# Altium schematic sheet fpga-misc-inside.SchDoc
size Letter; CheckedBy: E. Chiu; CompanyName: Brinton Engineering, LLC; DrawnBy: J. Brinton; Engineer: J. Brinton; Address1: 3479 Edison Way; Address2: Menlo Park CA 94025; Address3: +1 (877) 778-8435; Address4: brintonengineering.com; Revision: 1; SheetNumber: 18; SheetTotal: 60
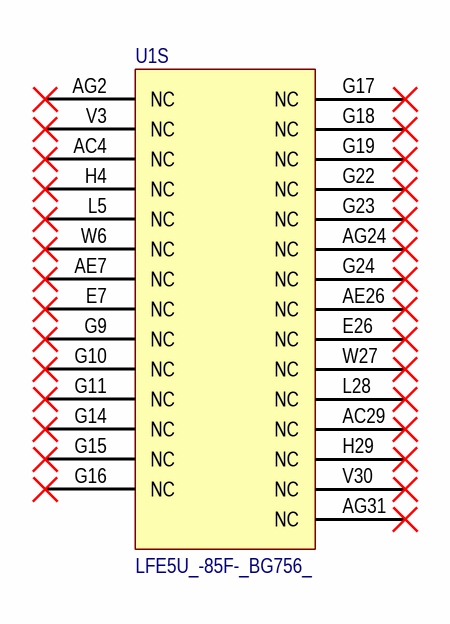
[diagram p0: fpga-misc-inside.SchDoc]

## Parts
U1  LFE5U_-85F-_BG756_  [caBGA756]  (part S of 19)

## Nets

Not connected (* = marked no-connect by the designer): U1 AC4(NC)* AC29(NC)* AE7(NC)* AE26(NC)* AG2(NC)* AG24(NC)* AG31(NC)* E7(NC)* E26(NC)* G9(NC)* G10(NC)* G11(NC)* G14(NC)* G15(NC)* G16(NC)* G17(NC)* G18(NC)* G19(NC)* G22(NC)* G23(NC)* G24(NC)* H4(NC)* H29(NC)* L5(NC)* L28(NC)* V3(NC)* V30(NC)* W6(NC)* W27(NC)*

## Notes on the sheet
- Title
- Engineer
- Revision
- Drawn By
- Checked By
- Date
- Sheet
- of

## Library data of the parts
U1 = LFE5U_-85F-_BG756_: ECP5 FPGA, 85k LUT, 756-caBGA; Manufacturer: Lattice Semiconductor; Manufacturer P/N: LFE5U_-85F-_BG756_